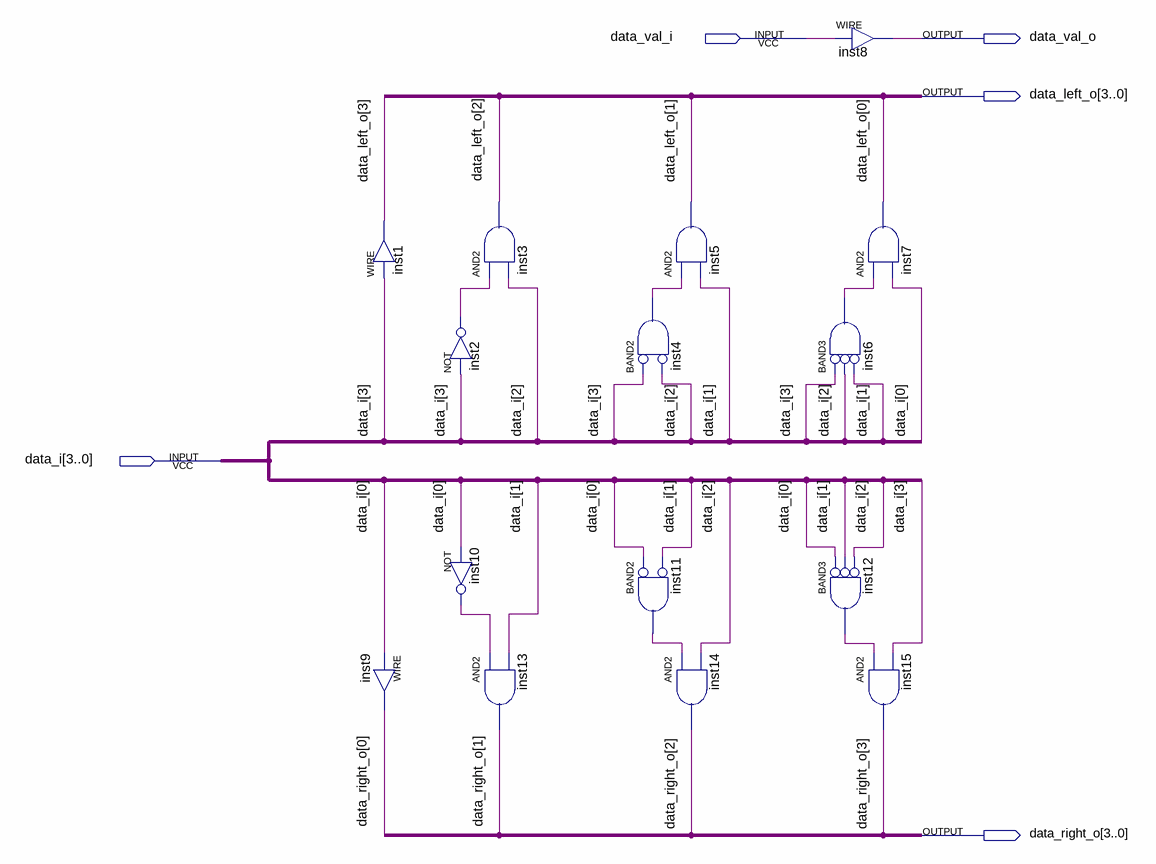
[diagram p0: schematic sheet]
// Quartus schematic priority_encoder_4_top.bdf as structural Verilog: 15 symbols, 5 pins
module priority_encoder_4_top (
  input  data_val_i,
  input  [3:0] data_i,
  output data_val_o,
  output [3:0] data_left_o,
  output [3:0] data_right_o
);

  wire inst2_out, inst4_out, inst6_out, inst10_out, inst11_out, inst12_out;

  assign data_left_o[3] = data_i[3];  // WIRE inst1
  assign data_right_o[0] = data_i[0];  // WIRE inst9
  and inst3 (data_left_o[2], inst2_out, data_i[2]);
  not inst2 (inst2_out, data_i[3]);
  not inst10 (inst10_out, data_i[0]);
  and inst13 (data_right_o[1], inst10_out, data_i[1]);
  and inst4 (inst4_out, ~data_i[3], ~data_i[2]);  // BAND2
  and inst11 (inst11_out, ~data_i[0], ~data_i[1]);  // BAND2
  and inst5 (data_left_o[1], inst4_out, data_i[1]);
  and inst14 (data_right_o[2], inst11_out, data_i[2]);
  assign data_val_o = data_val_i;  // WIRE inst8
  and inst7 (data_left_o[0], inst6_out, data_i[0]);
  and inst6 (inst6_out, ~data_i[3], ~data_i[2], ~data_i[1]);  // BAND3
  and inst12 (inst12_out, ~data_i[0], ~data_i[1], ~data_i[2]);  // BAND3
  and inst15 (data_right_o[3], inst12_out, data_i[3]);
endmodule
